# EAGLE design tick-display-mk-2 (EAGLE 6.5.0)
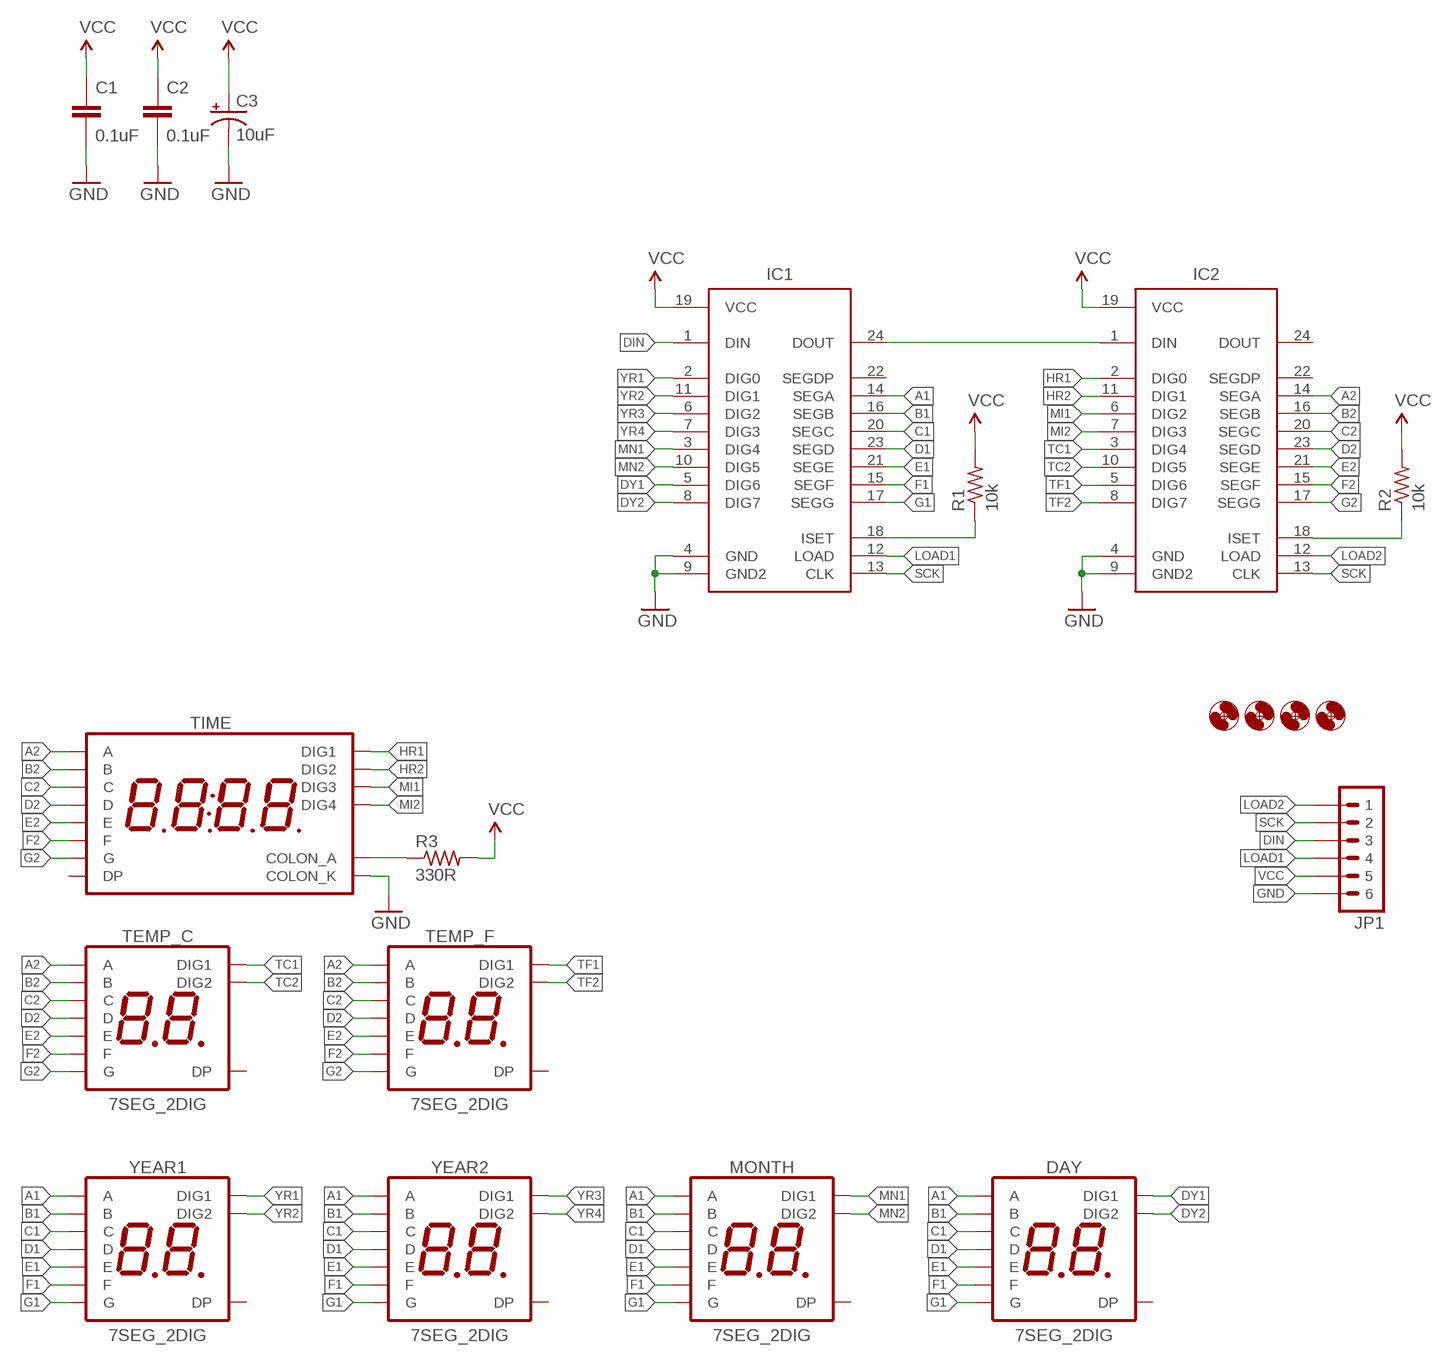
[diagram p0: schematic, sheet 1]

## Parts
C1  0.1uF  CAPACITOR-CERAMIC025-024X044  [C025-024X044]
C2  0.1uF  CAPACITOR-CERAMIC025-024X044  [C025-024X044]
C3  10uF  CAPACITOR-POLARIZEDE2-5  [E2-5]
DAY  7SEG_2DIG  [7SEG_2DIG_14MM]
H1  HOLE#2  [HOLE-#2]
H2  HOLE#2  [HOLE-#2]
H3  HOLE#2  [HOLE-#2]
H4  HOLE#2  [HOLE-#2]
IC1  MAX7219  MAX7219DIP  [DIL24]
IC2  MAX7219  MAX7219DIP  [DIL24]
JP1  M06JST-PH-PTH-VERT  [JST-6-PH-VERT-PTH]
MONTH  7SEG_2DIG  [7SEG_2DIG_14MM]
R1  10k  RESISTORPTH-AXIAL-5.08MM  [RESISTOR-AXIAL-PTH-5.08MM]
R2  10k  RESISTORPTH-AXIAL-5.08MM  [RESISTOR-AXIAL-PTH-5.08MM]
R3  330R  RESISTORPTH-AXIAL-5.08MM  [RESISTOR-AXIAL-PTH-5.08MM]
TEMP_C  7SEG_2DIG  [7SEG_2DIG_14MM]
TEMP_F  7SEG_2DIG  [7SEG_2DIG_14MM]
TIME  7SED_4DIGIT_14MM14.2MM-CC  [7SEG_4DIG]
YEAR1  7SEG_2DIG  [7SEG_2DIG_14MM]
YEAR2  7SEG_2DIG  [7SEG_2DIG_14MM]

## Nets
A1: DAY.4(A) IC1.14(SEGA) MONTH.4(A) YEAR1.4(A) YEAR2.4(A)
A2: IC2.14(SEGA) TEMP_C.4(A) TEMP_F.4(A) TIME.P$13(A)
B1: DAY.3(B) IC1.16(SEGB) MONTH.3(B) YEAR1.3(B) YEAR2.3(B)
B2: IC2.16(SEGB) TEMP_C.3(B) TEMP_F.3(B) TIME.P$9(B)
C1: DAY.9(C) IC1.20(SEGC) MONTH.9(C) YEAR1.9(C) YEAR2.9(C)
C2: IC2.20(SEGC) TEMP_C.9(C) TEMP_F.9(C) TIME.P$4(C)
D1: DAY.8(D) IC1.23(SEGD) MONTH.8(D) YEAR1.8(D) YEAR2.8(D)
D2: IC2.23(SEGD) TEMP_C.8(D) TEMP_F.8(D) TIME.P$2(D)
DIN: IC1.1(DIN) JP1.3
DY1: DAY.5(DIG1) IC1.5(DIG6)
DY2: DAY.10(DIG2) IC1.8(DIG7)
E1: DAY.6(E) IC1.21(SEGE) MONTH.6(E) YEAR1.6(E) YEAR2.6(E)
E2: IC2.21(SEGE) TEMP_C.6(E) TEMP_F.6(E) TIME.P$1(E)
F1: DAY.7(F) IC1.15(SEGF) MONTH.7(F) YEAR1.7(F) YEAR2.7(F)
F2: IC2.15(SEGF) TEMP_C.7(F) TEMP_F.7(F) TIME.P$12(F)
G1: DAY.1(G) IC1.17(SEGG) MONTH.1(G) YEAR1.1(G) YEAR2.1(G)
G2: IC2.17(SEGG) TEMP_C.1(G) TEMP_F.1(G) TIME.P$5(G)
GND: C1.2 C2.2 C3.- IC1.4(GND) IC1.9(GND2) IC2.4(GND) IC2.9(GND2) JP1.6 TIME.P$7(COLON_K)
HR1: IC2.2(DIG0) TIME.P$14(DIG1)
HR2: IC2.11(DIG1) TIME.P$11(DIG2)
LOAD1: IC1.12(LOAD) JP1.4
LOAD2: IC2.12(LOAD) JP1.1
MI1: IC2.6(DIG2) TIME.P$10(DIG3)
MI2: IC2.7(DIG3) TIME.P$6(DIG4)
MN1: IC1.3(DIG4) MONTH.5(DIG1)
MN2: IC1.10(DIG5) MONTH.10(DIG2)
N$2: IC1.18(ISET) R1.P$1
N$13: IC1.24(DOUT) IC2.1(DIN)
N$17: IC2.18(ISET) R2.P$1
N$18: R3.P$1 TIME.P$8(COLON_A)
SCK: IC1.13(CLK) IC2.13(CLK) JP1.2
TC1: IC2.3(DIG4) TEMP_C.5(DIG1)
TC2: IC2.10(DIG5) TEMP_C.10(DIG2)
TF1: IC2.5(DIG6) TEMP_F.5(DIG1)
TF2: IC2.8(DIG7) TEMP_F.10(DIG2)
VCC: C1.1 C2.1 C3.+ IC1.19(VCC) IC2.19(VCC) JP1.5 R1.P$2 R2.P$2 R3.P$2
YR1: IC1.2(DIG0) YEAR1.5(DIG1)
YR2: IC1.11(DIG1) YEAR1.10(DIG2)
YR3: IC1.6(DIG2) YEAR2.5(DIG1)
YR4: IC1.7(DIG3) YEAR2.10(DIG2)
Unconnected: DAY.2(DP) IC1.22(SEGDP) IC2.22(SEGDP) IC2.24(DOUT) MONTH.2(DP) TEMP_C.2(DP) TEMP_F.2(DP) TIME.P$3(DP) YEAR1.2(DP) YEAR2.2(DP)

## Library data of the parts
C1 C2 = A_butts:CAPACITOR-CERAMIC: CAPACITOR, European symbol
C3 = A_butts:CAPACITOR-POLARIZED: POLARIZED CAPACITOR, American symbol
DAY MONTH TEMP_C TEMP_F YEAR1 YEAR2 = A_butts:7SEG_2DIG
H1-H4 = A_butts:HOLE: MOUNTING HOLE with drill center marker
IC1 IC2 = A_butts:MAX7219: 8-digit, 8-segment LED display driver, serial input
JP1 = A_butts:M06: Header 6 Standard 6-pin 0.1" header. Use with straight break away headers (SKU : PRT-00116), right angle break away headers (PRT-00553), swiss pins (PRT-00743), machine pins (PRT-00117), and female headers (PRT-00115). Molex polarized connector foot print use with SKU : PRT-08094 with associated crimp pins and housings. NOTES ON THE VARIANTS LOCK and LOCK_LONGPADS... This footprint was designed to help hold the alignment of a through-hole component (i.e. 6-pin header) while soldering it into place. You may notice that each hole has been shifted either up or down by 0.005 of an inch from it's more standard position (which is a perfectly straight line). This slight alteration caused the pins (the squares in the middle) to touch the edges of the holes. Because they are alternating, it causes a "brace" to hold the component in place. 0.005 has proven to be the perfect amount of "off-center" position when using our standard breakaway headers. Although looks a little odd when you look at the bare footprint, once you have a header in there, the alteration is very hard to notice. Also,if you push a header all the way into place, it is covered up entirely on the bottom side. This idea of altering the position of holes to aid alignment will be further integrated into the Sparkfun Library for other footprints. It can help hold any component with 3 or more connection pins.
R1-R3 = A_butts:RESISTOR: RESISTOR, American symbol
TIME = A_butts:7SED_4DIGIT_14MM

## Board
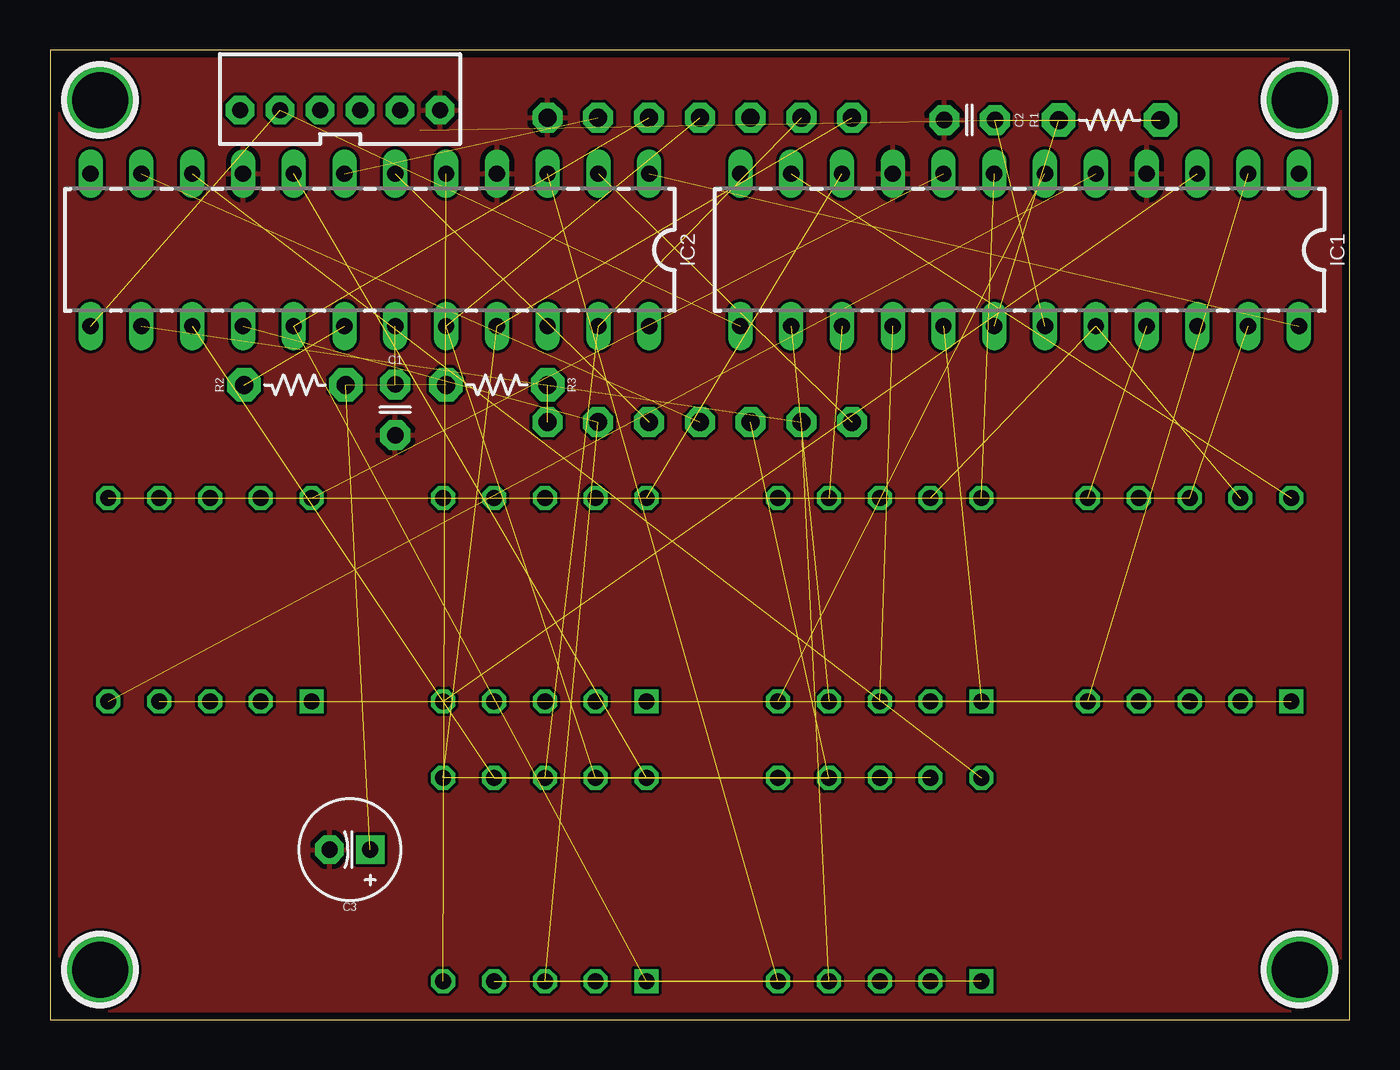
[diagram p1: board, top side]
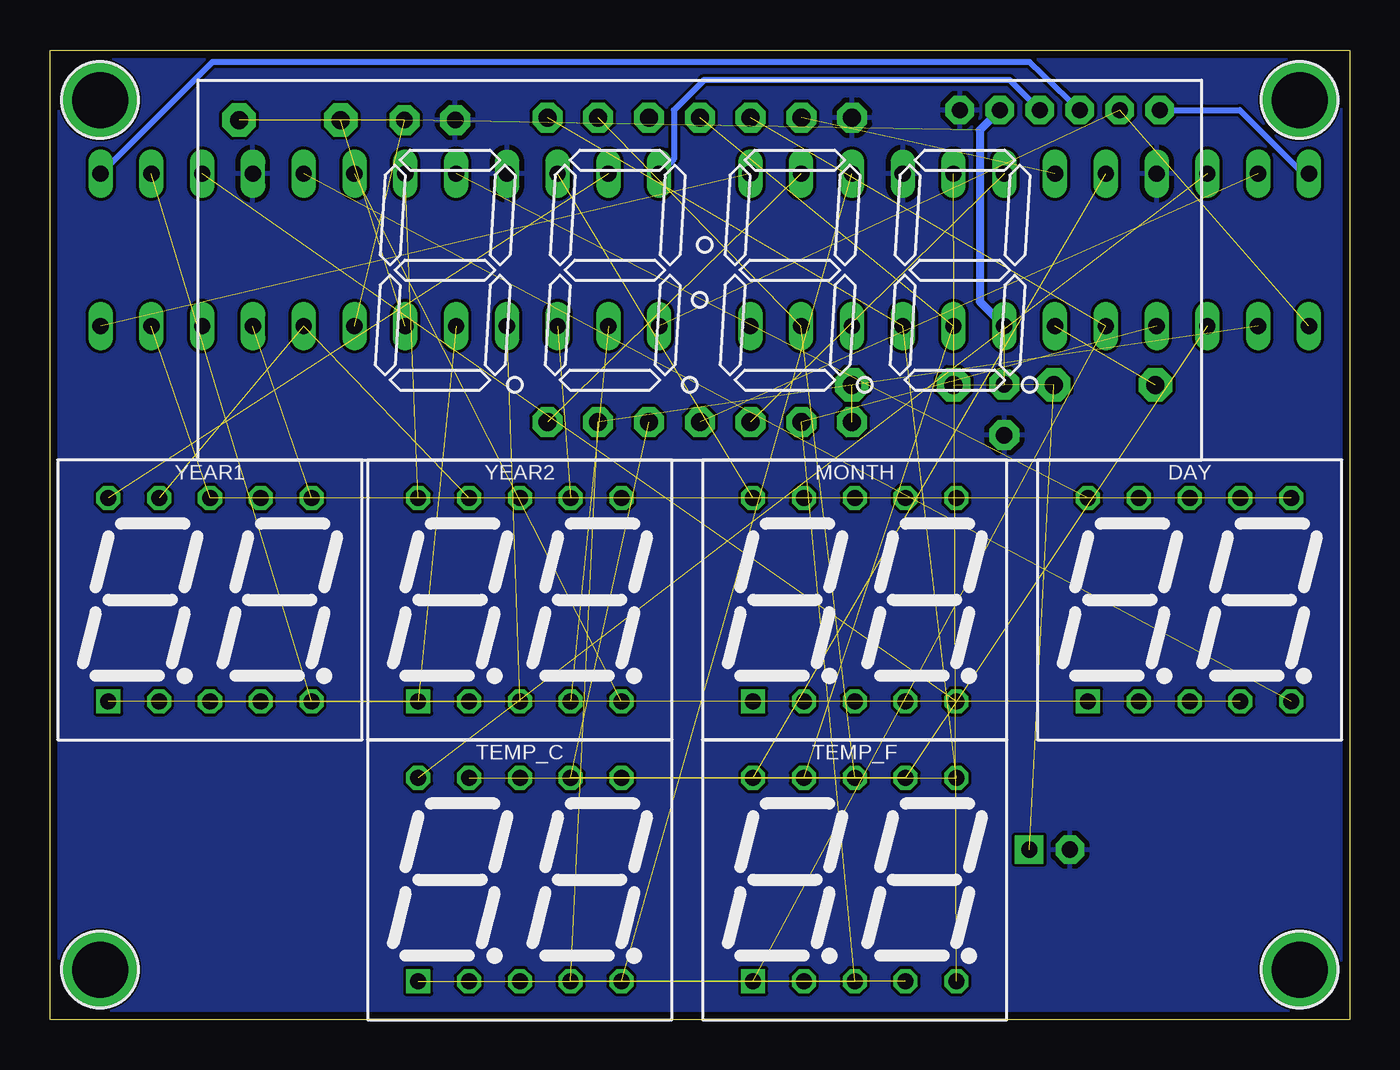
[diagram p2: board, bottom side, seen from below]

Size 65 x 48.5 mm. Coordinates in mm from the lower left corner, seen from the top.
Outline: 0,0 65,0 65,48.5 0,48.5 0,0
Copper layers (1*16): Top 0.0356mm / dielectric 1.5011mm / Bottom 0.0356mm
Design rules "LaenPCBOrder2": minimum track width 6mil, minimum drill 13mil, track to track 6mil, track to pad 6mil, pad to pad 6mil, via to via 6mil, smd to smd 6mil, copper to edge 15mil, drill to drill 6mil, minimum pad ring 7mil, minimum via ring 7mil, stop-mask expansion 3mil, vias tented up to drill 20mil, thermal gap 10mil

### Footprints (pad centres in the part's own frame; a part is rotated, then mirrored left to right if it is on the bottom)
C025-024X044 = drill 0.813 pad 1.5 octagon: 1 -1.27,0; 2 1.27,0
E2-5 = drill 0.813 pad 1.422 square: + -1.016,0 | drill 0.813 pad 1.422 octagon: - 1.016,0
7SEG_2DIG_14MM = drill 0.8 square: 1 -5.08,-5.08 | drill 0.8 octagon: 2 -2.54,-5.08; 3 0,-5.08; 4 2.54,-5.08; 5 5.08,-5.08; 6 5.08,5.08; 7 2.54,5.08; 8 0,5.08; 9 -2.54,5.08; 10 -5.08,5.08
HOLE-#2 = drill 2.8 pad 3.81: P$1 0,0
DIL24 = drill 0.813 long: 1 -13.97,-3.81; 2 -11.43,-3.81; 3 -8.89,-3.81; 4 -6.35,-3.81; 5 -3.81,-3.81; 6 -1.27,-3.81; 7 1.27,-3.81; 8 3.81,-3.81; 9 6.35,-3.81; 10 8.89,-3.81; 11 11.43,-3.81; 12 13.97,-3.81; 13 13.97,3.81; 14 11.43,3.81; 15 8.89,3.81; 16 6.35,3.81; 17 3.81,3.81; 18 1.27,3.81; 19 -1.27,3.81; 20 -3.81,3.81; 21 -6.35,3.81; 22 -8.89,3.81; 23 -11.43,3.81; 24 -13.97,3.81
JST-6-PH-VERT-PTH = drill 0.8 pad 1.422 octagon: 1 -5,0; 2 -3,0; 3 -1,0; 4 1,0; 5 3,0; 6 5,0
RESISTOR-AXIAL-PTH-5.08MM = drill 0.9 pad 1.676 octagon: P$1 -2.54,0; P$2 2.54,0
7SEG_4DIG = drill 0.9 pad 1.5 octagon: P$1 -7.62,7.62; P$2 -5.08,7.62; P$3 -2.54,7.62; P$4 0,7.62; P$5 2.54,7.62; P$6 5.08,7.62; P$7 7.62,7.62; P$8 7.62,-7.62; P$9 5.08,-7.62; P$10 2.54,-7.62; P$11 0,-7.62; P$12 -2.54,-7.62; P$13 -5.08,-7.62; P$14 -7.62,-7.62

### Placement (x,y rotation side)
C1  17.27,30.5 270 top
C2  46,45 180 top
C3  15,8.5 180 top
DAY  8,21 0 bottom
H1  2.5,46 0 top
H2  62.5,46 0 top
H3  2.5,2.5 0 top
H4  62.5,2.5 0 top
IC1  48.5,38.5 180 top
IC2  16,38.5 180 top
JP1  14.5,45.5 0 top
MONTH  24.75,21 0 bottom
R1  53,45 0 top
R2  12.25,31.75 0 top
R3  22.35,31.75 180 top
TEMP_C  41.5,7 0 bottom
TEMP_F  24.75,7 0 bottom
TIME  32.5,37.5 0 bottom
YEAR1  57,21 0 bottom
YEAR2  41.5,21 0 bottom

### Tracks (layer width: path | path; a pad name or v marks a point on that pad's centre or on a via)
A1  (4 unrouted)
A2  (3 unrouted)
B1  (4 unrouted)
B2  (3 unrouted)
C1  (4 unrouted)
C2  (3 unrouted)
D1  (4 unrouted)
D2  (3 unrouted)
DIN
  Bottom 0.305: JP1.3 16,47.9 56.88,47.9 IC1.1
DY1  (1 unrouted)
DY2  (1 unrouted)
E1  (4 unrouted)
E2  (3 unrouted)
F1  (4 unrouted)
F2  (3 unrouted)
G1  (4 unrouted)
G2  (3 unrouted)
GND
  pour Top: 0,0 0,48.5 65,48.5 65,0
  pour Bottom: 0,0 0,48.5 65,48.5 65,0
HR1  (1 unrouted)
HR2  (1 unrouted)
LOAD1
  Bottom 0.305: JP1.4 17,47 32.3,47 33.8,45.5 33.8,43.04 IC1.12
LOAD2
  Bottom 0.305: JP1.1 5.5,45.5 2.31,42.31 IC2.12
MI1  (1 unrouted)
MI2  (1 unrouted)
MN1  (1 unrouted)
MN2  (1 unrouted)
N$2  (1 unrouted)
N$13  (1 unrouted)
N$17  (1 unrouted)
N$18  (1 unrouted)
SCK  (2 unrouted)
TC1  (1 unrouted)
TC2  (1 unrouted)
TF1  (1 unrouted)
TF2  (1 unrouted)
VCC  (7 unrouted)
  Bottom 0.406: JP1.5 18.5,44.5 18.5,35.92 IC2.19
YR1  (1 unrouted)
YR2  (1 unrouted)
YR3  (1 unrouted)
YR4  (1 unrouted)